# Altium project ATMEGA1280.PRJPCB
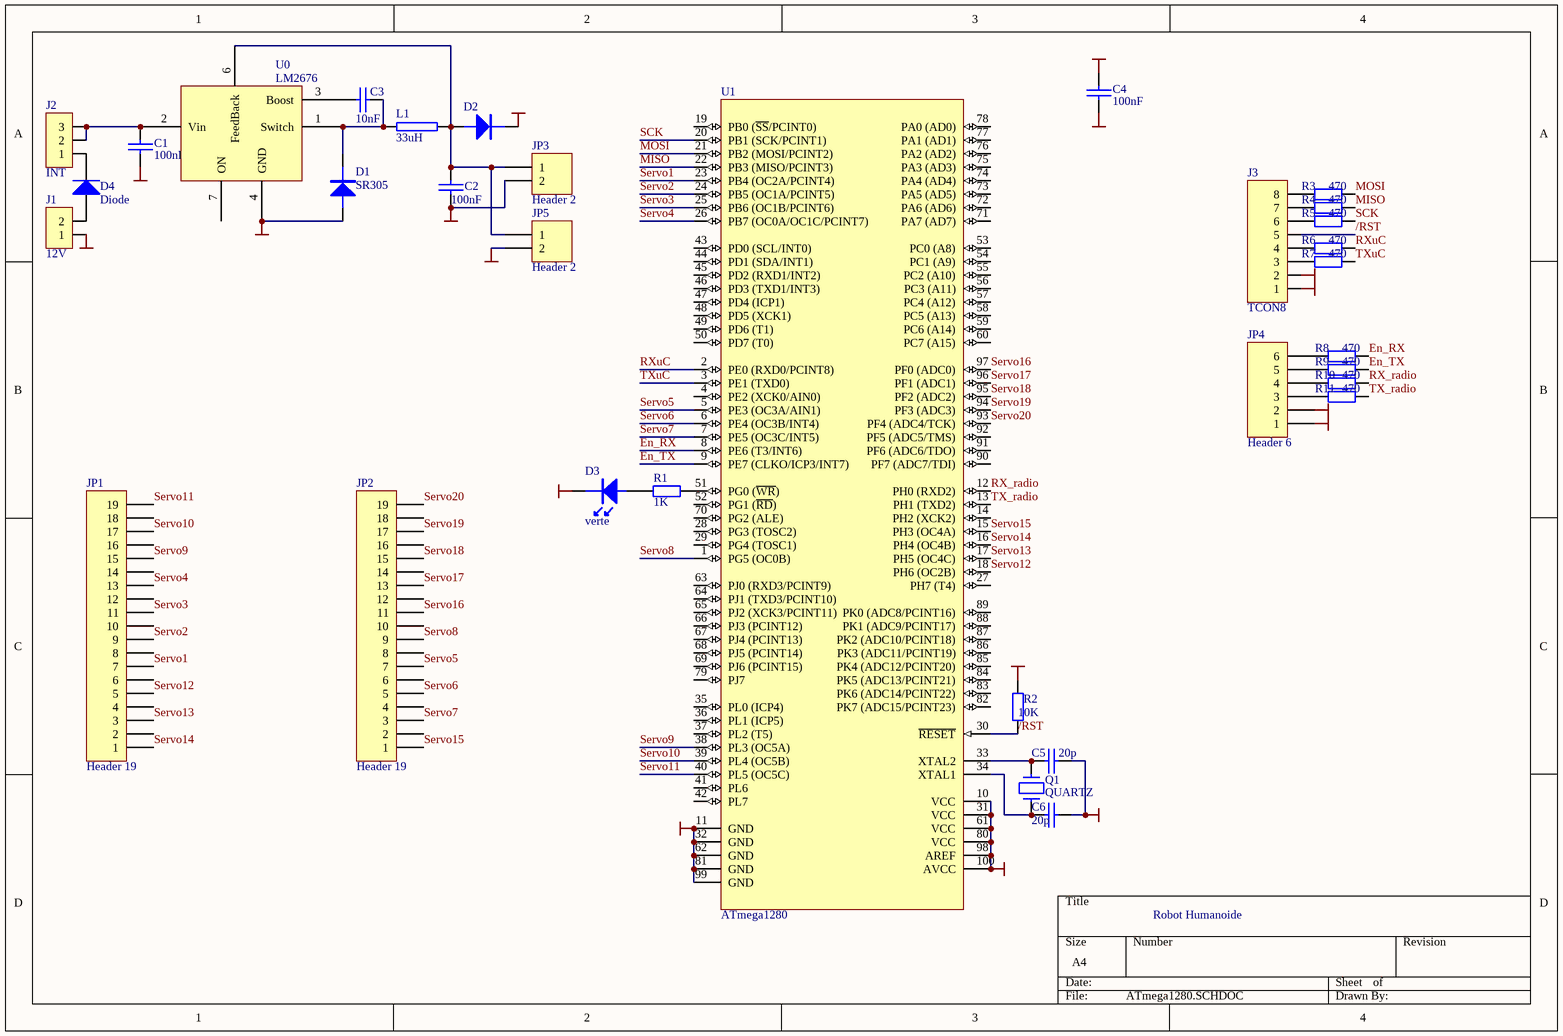
[diagram p0: ATmega1280.SCHDOC]
1 sheet, 33 parts. Net scope: global (net labels, ports and power ports of the same name join across sheets).
Board file: ATmega1280.PCBDOC

## Sheet ATmega1280.SCHDOC
size A4

### Parts
C1  100nF  [0805]
C2  100nF  [0805]
C3  10nF  [0805]
C4  100nF  [0805]
C5  20p  [0805]
C6  20p  [0805]
D1  SR305  [1812]
D2  (no value)  [1812]
D3  verte  [0603]
D4  Diode  [DSO-C2/X3.3]
J1  12V  [CON2]
J2  INT  [TSIP3]
J3  TCON8  [TSIP8]
JP1  Header 19  [HDR1X19]
JP2  Header 19  [HDR1X19]
JP3  Header 2  [HDR1X2]
JP4  Header 6  [TSIP6]
JP5  Header 2  [HDR1X2]
L1  33uH  [TRES]
Q1  QUARTZ  [XTAL1]
R1  value 1K  [0805]  (hidden comment: Res2)
R2  value 10K  [0805]  (hidden comment: Res2)
R3  value 470  [0805]  (hidden comment: Res2)
R4  value 470  [0805]  (hidden comment: Res2)
R5  value 470  [0805]  (hidden comment: Res2)
R6  value 470  [0805]  (hidden comment: Res2)
R7  value 470  [0805]  (hidden comment: Res2)
R8  value 470  [0805]  (hidden comment: Res2)
R9  value 470  [0805]  (hidden comment: Res2)
R10  value 470  [0805]  (hidden comment: Res2)
R11  value 470  [0805]  (hidden comment: Res2)
U0  LM2676  [LM2676]
U1  ATmega1280  [F-QFP14x14-G100/X.3N]

### Nets
5V: C4.2 D2.1 J3.1 JP4.1 R2.2 U1.10(VCC) U1.31(VCC) U1.61(VCC) U1.80(VCC) U1.98(AREF) U1.100(AVCC)
GND: C1.1 C2.1 C4.1 C5.1 C6.1 D1.2 D3.2 J1.1 J3.2 JP3.2 JP4.2 JP5.2 U0.4(GND) U1.11(GND) U1.32(GND) U1.62(GND) U1.81(GND) U1.99(GND)
/RST: J3.5 R2.1 U1.30(~{RESET})
En_RX: R8.2 U1.8(PE6_(T3/INT6))
En_TX: R9.2 U1.9(PE7_(CLKO/ICP3/INT7))
MISO: R4.2 U1.22(PB3_(MISO/PCINT3))
MOSI: R3.2 U1.21(PB2_(MOSI/PCINT2))
RX_radio: R10.2 U1.12(PH0_(RXD2))
RXuC: R6.2 U1.2(PE0_(RXD0/PCINT8))
SCK: R5.2 U1.20(PB1_(SCK/PCINT1))
Servo1: JP1.7 U1.23(PB4_(OC2A/PCINT4))
Servo2: JP1.9 U1.24(PB5_(OC1A/PCINT5))
Servo3: JP1.11 U1.25(PB6_(OC1B/PCINT6))
Servo4: JP1.13 U1.26(PB7_(OC0A/OC1C/PCINT7))
Servo5: JP2.7 U1.5(PE3_(OC3A/AIN1))
Servo6: JP2.5 U1.6(PE4_(OC3B/INT4))
Servo7: JP2.3 U1.7(PE5_(OC3C/INT5))
Servo8: JP2.9 U1.1(PG5_(OC0B))
Servo9: JP1.15 U1.38(PL3_(OC5A))
Servo10: JP1.17 U1.39(PL4_(OC5B))
Servo11: JP1.19 U1.40(PL5_(OC5C))
Servo12: JP1.5 U1.18(PH6_(OC2B))
Servo13: JP1.3 U1.17(PH5_(OC4C))
Servo14: JP1.1 U1.16(PH4_(OC4B))
Servo15: JP2.1 U1.15(PH3_(OC4A))
Servo16: JP2.11 U1.97(PF0_(ADC0))
Servo17: JP2.13 U1.96(PF1_(ADC1))
Servo18: JP2.15 U1.95(PF2_(ADC2))
Servo19: JP2.17 U1.94(PF3_(ADC3))
Servo20: JP2.19 U1.93(PF4_(ADC4/TCK))
TX_radio: R11.2 U1.13(PH1_(TXD2))
TXuC: R7.2 U1.3(PE1_(TXD0))
NetC1_2: C1.2 J2.2 J2.3 U0.2(Vin)
NetC2_2: C2.2 D2.2 JP3.1 JP5.1 L1.2 U0.6(FeedBack)
NetC3_1: C3.1 U0.3(Boost)
NetC3_2: C3.2 D1.1 L1.1 U0.1(Switch)
NetC5_2: C5.2 Q1.1 U1.33(XTAL2)
NetC6_2: C6.2 Q1.2 U1.34(XTAL1)
NetD3_1: D3.1 R1.1
NetD4_1: D4.1(A) J1.2
NetD4_2: D4.2(K) J2.1
NetJ3_3: J3.3 R7.1
NetJ3_4: J3.4 R6.1
NetJ3_6: J3.6 R5.1
NetJ3_7: J3.7 R4.1
NetJ3_8: J3.8 R3.1
NetJP4_3: JP4.3 R11.1
NetJP4_4: JP4.4 R10.1
NetJP4_5: JP4.5 R9.1
NetJP4_6: JP4.6 R8.1
NetR1_2: R1.2 U1.51(PG0_(~{WR}))

Not connected (* = marked no-connect by the designer): JP1 2 4 6 8 10 12 14 16 18; JP2 2 4 6 8 10 12 14 16 18; U0 7(ON); U1 4(PE2_(XCK0/AIN0)) 14(PH2_(XCK2)) 19(PB0_(~{SS}/PCINT0)) 27(PH7_(T4)) 28(PG3_(TOSC2)) 29(PG4_(TOSC1)) 35(PL0_(ICP4)) 36(PL1_(ICP5)) 37(PL2_(T5)) 41(PL6) 42(PL7) 43(PD0_(SCL/INT0)) 44(PD1_(SDA/INT1)) 45(PD2_(RXD1/INT2)) 46(PD3_(TXD1/INT3)) 47(PD4_(ICP1)) 48(PD5_(XCK1)) 49(PD6_(T1)) 50(PD7_(T0)) 52(PG1_(~{RD})) 53(PC0_(A8)) 54(PC1_(A9)) 55(PC2_(A10)) 56(PC3_(A11)) 57(PC4_(A12)) 58(PC5_(A13)) 59(PC6_(A14)) 60(PC7_(A15)) 63(PJ0_(RXD3/PCINT9)) 64(PJ1_(TXD3/PCINT10)) 65(PJ2_(XCK3/PCINT11)) 66(PJ3_(PCINT12)) 67(PJ4_(PCINT13)) 68(PJ5_(PCINT14)) 69(PJ6_(PCINT15)) 70(PG2_(ALE)) 71(PA7_(AD7)) 72(PA6_(AD6)) 73(PA5_(AD5)) 74(PA4_(AD4)) 75(PA3_(AD3)) 76(PA2_(AD2)) 77(PA1_(AD1)) 78(PA0_(AD0)) 79(PJ7) 82(PK7_(ADC15/PCINT23)) 83(PK6_(ADC14/PCINT22)) 84(PK5_(ADC13/PCINT21)) 85(PK4_(ADC12/PCINT20)) 86(PK3_(ADC11/PCINT19)) 87(PK2_(ADC10/PCINT18)) 88(PK1_(ADC9/PCINT17)) 89(PK0_(ADC8/PCINT16)) 90(PF7_(ADC7/TDI)) 91(PF6_(ADC6/TDO)) 92(PF5_(ADC5/TMS))

### Notes on the sheet
- Robot Humanoide

### Library data of the parts
C1 C2 C4 = CAP: Part Field 1: 08/06/2000; Part Field 2: Altium Hobart Technology Centre; Part Field 3: Generic Components; Part Field 4: Passive; Part Field 5: Capacitor
C3 C5 C6 = CONDO
D1 D2 = DIODE
D3 = LED
D4 = Diode: Default Diode; Code - JEDEC: DO-214-AB; Published: 8-Jun-2000; Revision: July-2002: Re-released for DXP Platform.; Publisher: Altium Limited
J1 = CON2
J2 = TCON3
JP1 JP2 = Header 19: Header, 19-Pin; Revision: 17-Jul-2002: Re-released for DXP Platform.; Publisher: Altium Limited
JP3 JP5 = Header 2: Header, 2-Pin; Revision: 17-Jul-2002: Re-released for DXP Platform.; Publisher: Altium Limited
JP4 = Header 6: Header, 6-Pin; Revision: 17-Jul-2002: Re-released for DXP Platform.; Publisher: Altium Limited
L1 = RES2: Published: *; Publisher: *; Manufacturer: *; Class: *; SubClass: *
R1-R11 = Res2: Resistor; Published: 8-Jun-2000; Revision: July-2002: Re-released for DXP Platform.; Publisher: Altium Limited